# Altium schematic sheet balancerTest.SchDoc
size A4
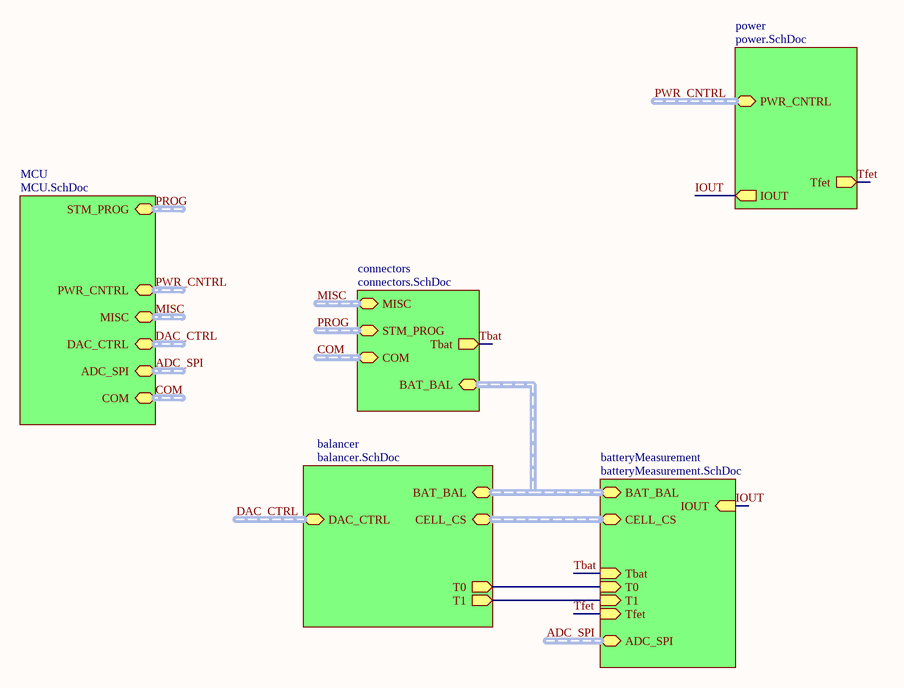
[diagram p0: balancerTest.SchDoc]

## Sub-sheets
balancer = balancer.SchDoc: BAT_BAL (harness BAT_BAL), CELL_CS (harness CELL_CS), DAC_CTRL (harness DAC_CTRL), T0 (out), T1 (out)
batteryMeasurement = batteryMeasurement.SchDoc: BAT_BAL (harness BAT_BAL), CELL_CS (harness CELL_CS), ADC_SPI (harness ADC_SPI), T0 (in), T1 (in), Tbat (in), IOUT (in), Tfet (in)
connectors = connectors.SchDoc: BAT_BAL (harness BAT_BAL), Tbat (out), MISC (harness MISC), STM_PROG (harness PROGRAMMING), COM (harness COM)
MCU = MCU.SchDoc: MISC (harness MISC), DAC_CTRL (harness DAC_CTRL), ADC_SPI (harness ADC_SPI), PWR_CNTRL (harness PWR_CNTRL), STM_PROG (harness PROGRAMMING), COM (harness COM)
power = power.SchDoc: IOUT (out), Tfet (out), PWR_CNTRL (harness PWR_CNTRL)

## Nets
IOUT: sheet power/IOUT, sheet batteryMeasurement/IOUT
Tbat: sheet connectors/Tbat, sheet batteryMeasurement/Tbat
Tfet: sheet power/Tfet, sheet batteryMeasurement/Tfet
(unnamed): sheet balancer/T0, sheet batteryMeasurement/T0
(unnamed): sheet balancer/T1, sheet batteryMeasurement/T1

## Buses and harness runs
harness ADC_SPI = sheet batteryMeasurement/ADC_SPI
harness ADC_SPI = sheet MCU/ADC_SPI
harness COM = sheet connectors/COM
harness COM = sheet MCU/COM
harness DAC_CTRL = sheet balancer/DAC_CTRL
harness DAC_CTRL = sheet MCU/DAC_CTRL
harness MISC = sheet connectors/MISC
harness MISC = sheet MCU/MISC
harness PROG = sheet connectors/STM_PROG
harness PROG = sheet MCU/STM_PROG
harness PWR_CNTRL = sheet MCU/PWR_CNTRL
harness PWR_CNTRL = sheet power/PWR_CNTRL
harness sheet balancer/BAT_BAL = sheet batteryMeasurement/BAT_BAL = sheet connectors/BAT_BAL
harness sheet balancer/CELL_CS = sheet batteryMeasurement/CELL_CS